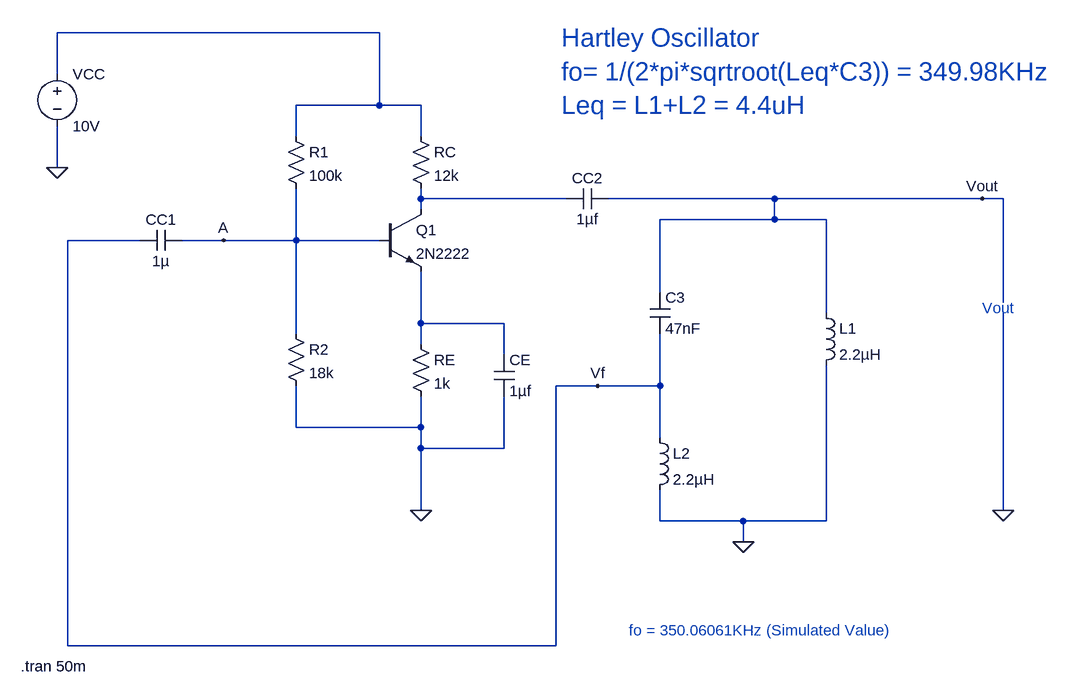
[diagram p0: schematic Hartley_Oscillator.asc]
Hartley_Oscillator.asc, the LTspice schematic file:
Version 4
SHEET 1 1680 944
WIRE 528 -48 32 -48
WIRE 32 16 32 -48
WIRE 528 64 528 -48
WIRE 528 64 400 64
WIRE 592 64 528 64
WIRE 400 112 400 64
WIRE 592 112 592 64
WIRE 32 160 32 96
WIRE 592 208 592 192
WIRE 816 208 592 208
WIRE 1136 208 880 208
WIRE 1456 208 1136 208
WIRE 1488 208 1456 208
WIRE 592 224 592 208
WIRE 1136 240 1136 208
WIRE 1136 240 960 240
WIRE 1216 240 1136 240
WIRE 160 272 48 272
WIRE 288 272 224 272
WIRE 400 272 400 192
WIRE 400 272 288 272
WIRE 528 272 400 272
WIRE 960 352 960 240
WIRE 1488 368 1488 208
WIRE 1216 384 1216 240
WIRE 592 400 592 320
WIRE 720 400 592 400
WIRE 400 416 400 272
WIRE 592 432 592 400
WIRE 720 448 720 400
WIRE 864 496 800 496
WIRE 960 496 960 416
WIRE 960 496 864 496
WIRE 400 560 400 496
WIRE 592 560 592 512
WIRE 592 560 400 560
WIRE 960 576 960 496
WIRE 592 592 592 560
WIRE 720 592 720 512
WIRE 720 592 592 592
WIRE 592 688 592 592
WIRE 1488 688 1488 384
WIRE 960 704 960 656
WIRE 1088 704 960 704
WIRE 1216 704 1216 464
WIRE 1216 704 1088 704
WIRE 1088 736 1088 704
WIRE 48 896 48 272
WIRE 800 896 800 496
WIRE 800 896 48 896
FLAG 1088 736 0
FLAG 1488 688 0
FLAG 592 688 0
FLAG 288 272 A
FLAG 864 496 Vf
FLAG 1456 208 Vout
FLAG 32 160 0
SYMBOL voltage 32 0 R0
WINDOW 123 0 0 Left 0
WINDOW 39 0 0 Left 0
SYMATTR InstName VCC
SYMATTR Value 10V
SYMBOL res 384 96 R0
SYMATTR InstName R1
SYMATTR Value 100k
SYMBOL res 384 400 R0
SYMATTR InstName R2
SYMATTR Value 18k
SYMBOL res 576 416 R0
SYMATTR InstName RE
SYMATTR Value 1k
SYMBOL cap 160 288 R270
WINDOW 0 32 32 VTop 2
WINDOW 3 0 32 VBottom 2
SYMATTR InstName CC1
SYMATTR Value 1µ
SYMBOL cap 816 224 R270
WINDOW 0 32 32 VTop 2
WINDOW 3 0 32 VBottom 2
SYMATTR InstName CC2
SYMATTR Value 1µf
SYMBOL cap 944 352 R0
SYMATTR InstName C3
SYMATTR Value 47nF
SYMBOL res 576 96 R0
SYMATTR InstName RC
SYMATTR Value 12k
SYMBOL npn 528 224 R0
SYMATTR InstName Q1
SYMATTR Value 2N2222
SYMBOL ind 944 560 R0
SYMATTR InstName L2
SYMATTR Value 2.2µH
SYMBOL ind 1200 368 R0
SYMATTR InstName L1
SYMATTR Value 2.2µH
SYMBOL cap 704 448 R0
SYMATTR InstName CE
SYMATTR Value 1µf
TEXT 1456 376 Left 2 ;Vout
TEXT -24 928 Left 2 !.tran 50m
TEXT 808 -40 Left 4 ;Hartley Oscillator\nfo= 1/(2*pi*sqrtroot(Leq*C3)) = 349.98KHz\nLeq = L1+L2 = 4.4uH
TEXT 912 872 Left 2 ;fo = 350.06061KHz (Simulated Value)

The netlist it stands for:
* Hartley_Oscillator.asc
VCC N001 0 10V
R1 N001 A 100k
R2 A 0 18k
RE N003 0 1k
CC1 Vf A 1µ
CC2 N002 Vout 1µf
C3 Vout Vf 47nF
RC N001 N002 12k
Q1 N002 A N003 0 2N2222
L2 Vf 0 2.2µH
L1 Vout 0 2.2µH
CE N003 0 1µf
.model NPN NPN
.model PNP PNP
.lib standard.bjt
* Vout
.tran 50m
* Hartley Oscillator
* fo= 1/(2*pi*sqrtroot(Leq*C3)) = 349.98KHz
* Leq = L1+L2 = 4.4uH
* fo = 350.06061KHz (Simulated Value)
.backanno
.end